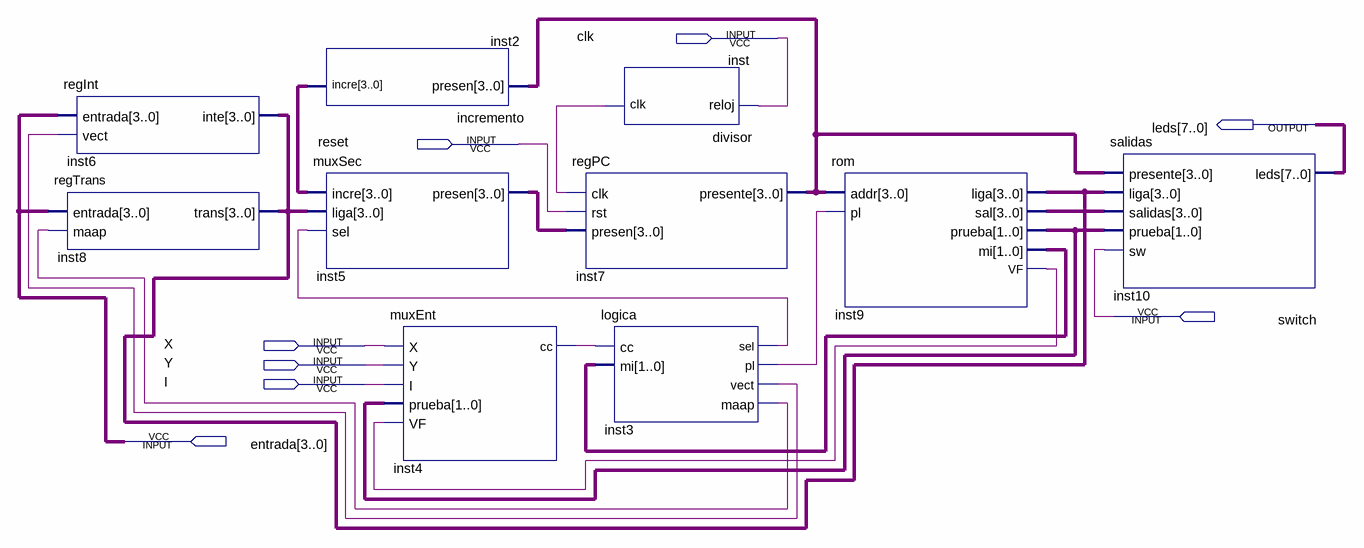
[diagram p0: schematic sheet]
// Quartus schematic prac6.bdf as structural Verilog: 10 symbols, 8 pins
module prac6 (
  input  clk,
  input  reset,
  input  switch,
  input  X,
  input  Y,
  input  I,
  input  [3:0] entrada,
  output [7:0] leds
);

  wire inst3_maap, inst3_pl, inst3_sel, inst3_vect, inst4_cc, inst9_vf, inst_clk;
  wire [1:0] inst9_mi, inst9_prueba;
  wire [3:0] inst2_incre, inst5_presen, inst6_inte, inst7_presente, inst9_sal;

  regInt inst6 (.entrada(entrada), .vect(inst3_vect), .inte(inst6_inte));
  regTrans inst8 (.entrada(entrada), .maap(inst3_maap), .trans(inst6_inte));
  incremento inst2 (.presen(inst7_presente), .incre(inst2_incre));
  muxSec inst5 (.incre(inst2_incre), .liga(inst6_inte), .sel(inst3_sel), .presen(inst5_presen));
  muxEnt inst4 (.X(X), .Y(Y), .I(I), .prueba(inst9_prueba), .VF(inst9_vf), .cc(inst4_cc));
  divisor inst (.reloj(clk), .clk(inst_clk));
  regPC inst7 (.clk(inst_clk), .rst(reset), .presen(inst5_presen), .presente(inst7_presente));
  logica inst3 (.cc(inst4_cc), .mi(inst9_mi), .sel(inst3_sel), .pl(inst3_pl), .vect(inst3_vect), .maap(inst3_maap));
  rom inst9 (
    .addr(inst7_presente), .pl(inst3_pl), .liga(inst6_inte), .sal(inst9_sal), .prueba(inst9_prueba),
    .mi(inst9_mi), .VF(inst9_vf));
  salidas inst10 (
    .presente(inst7_presente), .liga(inst6_inte), .salidas(inst9_sal), .prueba(inst9_prueba), .sw(switch),
    .leds(leds));
endmodule
